# EAGLE design Hall Effect Arduino (EAGLE 6.5.0)
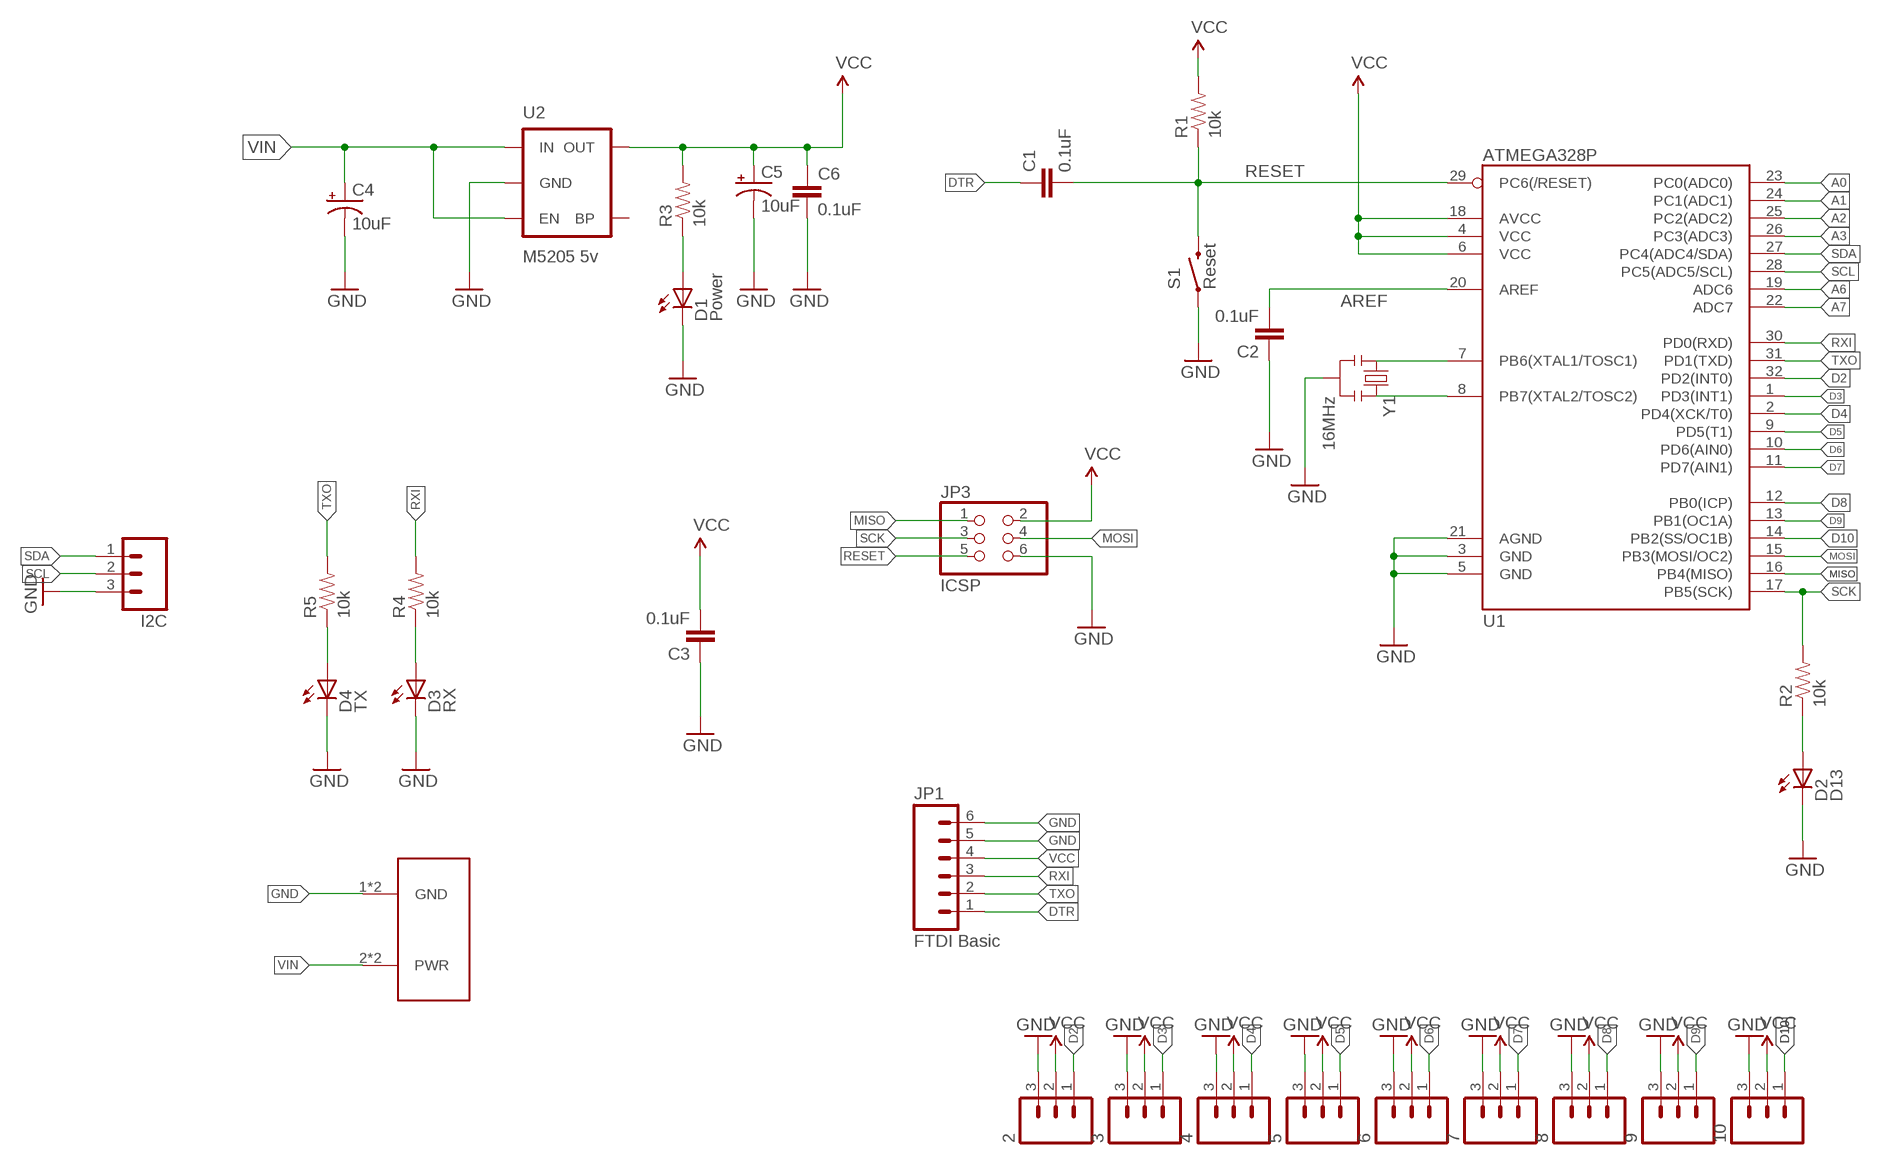
[diagram p0: schematic, sheet 1]

## Parts
2  M03PTH  [1X03]
3  M03PTH  [1X03]
4  M03PTH  [1X03]
5  M03PTH  [1X03]
6  M03PTH  [1X03]
7  M03PTH  [1X03]
8  M03PTH  [1X03]
9  M03PTH  [1X03]
10  M03PTH  [1X03]
C1  0.1uF  CAP0603-CAP  [0603-CAP]
C2  0.1uF  CAP0603-CAP  [0603-CAP]
C3  0.1uF  CAP0603-CAP  [0603-CAP]
C4  10uF  CAP_POL1206  [EIA3216]
C5  10uF  CAP_POL1206  [EIA3216]
C6  0.1uF  CAP0603-CAP  [0603-CAP]
D1  Power  LED-RED0603  [LED-0603]
D2  D13  LED-RED0603  [LED-0603]
D3  RX  LED-GREEN0603  [LED-0603]
D4  TX  LED-RED0603  [LED-0603]
I2C  M03PTH  [1X03]
JP1  FTDI Basic  M06SIP  [1X06]
JP3  ICSP  PINHD-2X3  [2X03]
R1  10k  RESISTOR0603-RES  [0603-RES]
R2  10k  RESISTOR0603-RES  [0603-RES]
R3  10k  RESISTOR0603-RES  [0603-RES]
R4  10k  RESISTOR0603-RES  [0603-RES]
R5  10k  RESISTOR0603-RES  [0603-RES]
S1  Reset  SWITCH-MOMENTARY-2SMD  [TACTILE_SWITCH_SMD]
U1  ATMEGA328P  ATMEGA328_SMT  [TQFP32-08]
U2  M5205 5v  MIC52055V  [SOT23-5]
U$1  LSF-SMT  [LSF-SMT]
Y1  16MHz  RESONATOR16MHZ  [RESONATOR-SMD]

## Nets
A0: U1.23(PC0(ADC0))
A1: U1.24(PC1(ADC1))
A2: U1.25(PC2(ADC2))
A3: U1.26(PC3(ADC3))
A6: U1.19(ADC6)
A7: U1.22(ADC7)
AREF: C2.2 U1.20(AREF)
D2: 2.1 U1.32(PD2(INT0))
D3: 3.1 U1.1(PD3(INT1))
D4: 4.1 U1.2(PD4(XCK/T0))
D5: 5.1 U1.9(PD5(T1))
D6: 6.1 U1.10(PD6(AIN0))
D7: 7.1 U1.11(PD7(AIN1))
D8: 8.1 U1.12(PB0(ICP))
D9: 9.1 U1.13(PB1(OC1A))
D10: 10.1 U1.14(PB2(SS/OC1B))
DTR: C1.1 JP1.1
GND: 2.3 3.3 4.3 5.3 6.3 7.3 8.3 9.3 10.3 C2.1 C3.1 C4.C(-) C5.C(-) C6.2 D1.C D2.C D3.C D4.C I2C.3 JP1.5 JP1.6 JP3.6 S1.1 U1.3(GND) U1.5(GND) U1.21(AGND) U2.2(GND) U$1.1(GND) U$1.1-2(GND) Y1.2
MISO: JP3.1 U1.16(PB4(MISO))
MOSI: JP3.4 U1.15(PB3(MOSI/OC2))
N$1: U1.7(PB6(XTAL1/TOSC1)) Y1.1
N$2: U1.8(PB7(XTAL2/TOSC2)) Y1.3
N$3: D1.A R3.1
N$4: D2.A R2.1
N$5: D3.A R4.1
N$6: D4.A R5.1
RESET: C1.2 JP3.5 R1.1 S1.3 U1.29(PC6(/RESET))
RXI: JP1.3 R4.2 U1.30(PD0(RXD))
SCK: JP3.3 R2.2 U1.17(PB5(SCK))
SCL: I2C.2 U1.28(PC5(ADC5/SCL))
SDA: I2C.1 U1.27(PC4(ADC4/SDA))
TXO: JP1.2 R5.2 U1.31(PD1(TXD))
VCC: 2.2 3.2 4.2 5.2 6.2 7.2 8.2 9.2 10.2 C3.2 C5.A(+) C6.1 JP1.4 JP3.2 R1.2 R3.2 U1.4(VCC) U1.6(VCC) U1.18(AVCC) U2.5(OUT)
VIN: C4.A(+) U2.1(IN) U2.3(EN) U$1.2(PWR) U$1.2-2(PWR)
Unconnected: U2.4(BP)

## Library data of the parts
2-10 I2C = SparkFun-Connectors:M03: Header 3 Standard 3-pin 0.1" header. Use with straight break away headers (SKU : PRT-00116), right angle break away headers (PRT-00553), swiss pins (PRT-00743), machine pins (PRT-00117), and female headers (PRT-00115). Molex polarized connector foot print use with SKU : PRT-08232 with associated crimp pins and housings.
C1-C3 C6 = SparkFun-Passives:CAP: Capacitor Standard 0603 ceramic capacitor, and 0.1" leaded capacitor.
C4 C5 = SparkFun-Passives:CAP_POL: Capacitor Polarized These are standard SMD and PTH capacitors. Normally 10uF, 47uF, and 100uF in electrolytic and tantalum varieties. Always verify the external diameter of the through hole cap, it varies with capacity, voltage, and manufacturer. The EIA devices should be standard.
D1 D2 D4 = SparkFun-LED:LED-RED: Assorted Red LEDs LilyPad 1206- DIO-09912 1206- DIO-00809 0603- DIO-00819; PROD_ID: DIO-00819; VALUE: RED
D3 = SparkFun-LED:LED-GREEN: Various green LEDs Green LEDs used in SFE Production 0603- DIO-00821 LARGE- DIO-00862 LILYPAD- DIO-09910; PROD_ID: DIO-00821; VALUE: GREEN
JP1 = SparkFun-Connectors:M06: Header 6 Standard 6-pin 0.1" header. Use with straight break away headers (SKU : PRT-00116), right angle break away headers (PRT-00553), swiss pins (PRT-00743), machine pins (PRT-00117), and female headers (PRT-00115). Molex polarized connector foot print use with SKU : PRT-08094 with associated crimp pins and housings. NOTES ON THE VARIANTS LOCK and LOCK_LONGPADS... This footprint was designed to help hold the alignment of a through-hole component (i.e. 6-pin header) while soldering it into place. You may notice that each hole has been shifted either up or down by 0.005 of an inch from it's more standard position (which is a perfectly straight line). This slight alteration caused the pins (the squares in the middle) to touch the edges of the holes. Because they are alternating, it causes a "brace" to hold the component in place. 0.005 has proven to be the perfect amount of "off-center" position when using our standard breakaway headers. Although looks a little odd when you look at the bare footprint, once you have a header in there, the alteration is very hard to notice. Also,if you push a header all the way into place, it is covered up entirely on the bottom side. This idea of altering the position of holes to aid alignment will be further integrated into the Sparkfun Library for other footprints. It can help hold any component with 3 or more connection pins.
JP3 = SparkFun-Connectors:PINHD-2X3: PIN HEADER
R1-R5 = SparkFun-Passives:RESISTOR: Resistor Basic schematic elements and footprints for 0603, 1206, and PTH resistors.
S1 = SparkFun-Electromechanical:SWITCH-MOMENTARY-2: Various NO switches- pushbuttons, reed, etc; PROD_ID: SWCH-08247
U1 = SparkFun-DigitalIC:ATMEGA328_SMT: 32-Pin Atmega328 part Commonly used on Arduino compatible boards Available in QFP and QFN packages TQFP is IC-09069 QFN is non-stock; PROD_ID: IC-09069
U2 = SparkFun-PowerIC:MIC5205: MIC5205 150mA vreg 3.3V - VREG-00822 5V - VREG-00823; PROD_ID: VREG-00823
U$1 = LSF-SMT:LSF-SMT
Y1 = SparkFun-FreqCtrl:RESONATOR: Resonator Small SMD resonator. Used, eg, on the Arduino Pro/ Pro Mini boards. 8MHz- XTAL-08895 16MHz- XTAL-08900; PROD_ID: XTAL-08900

## Board
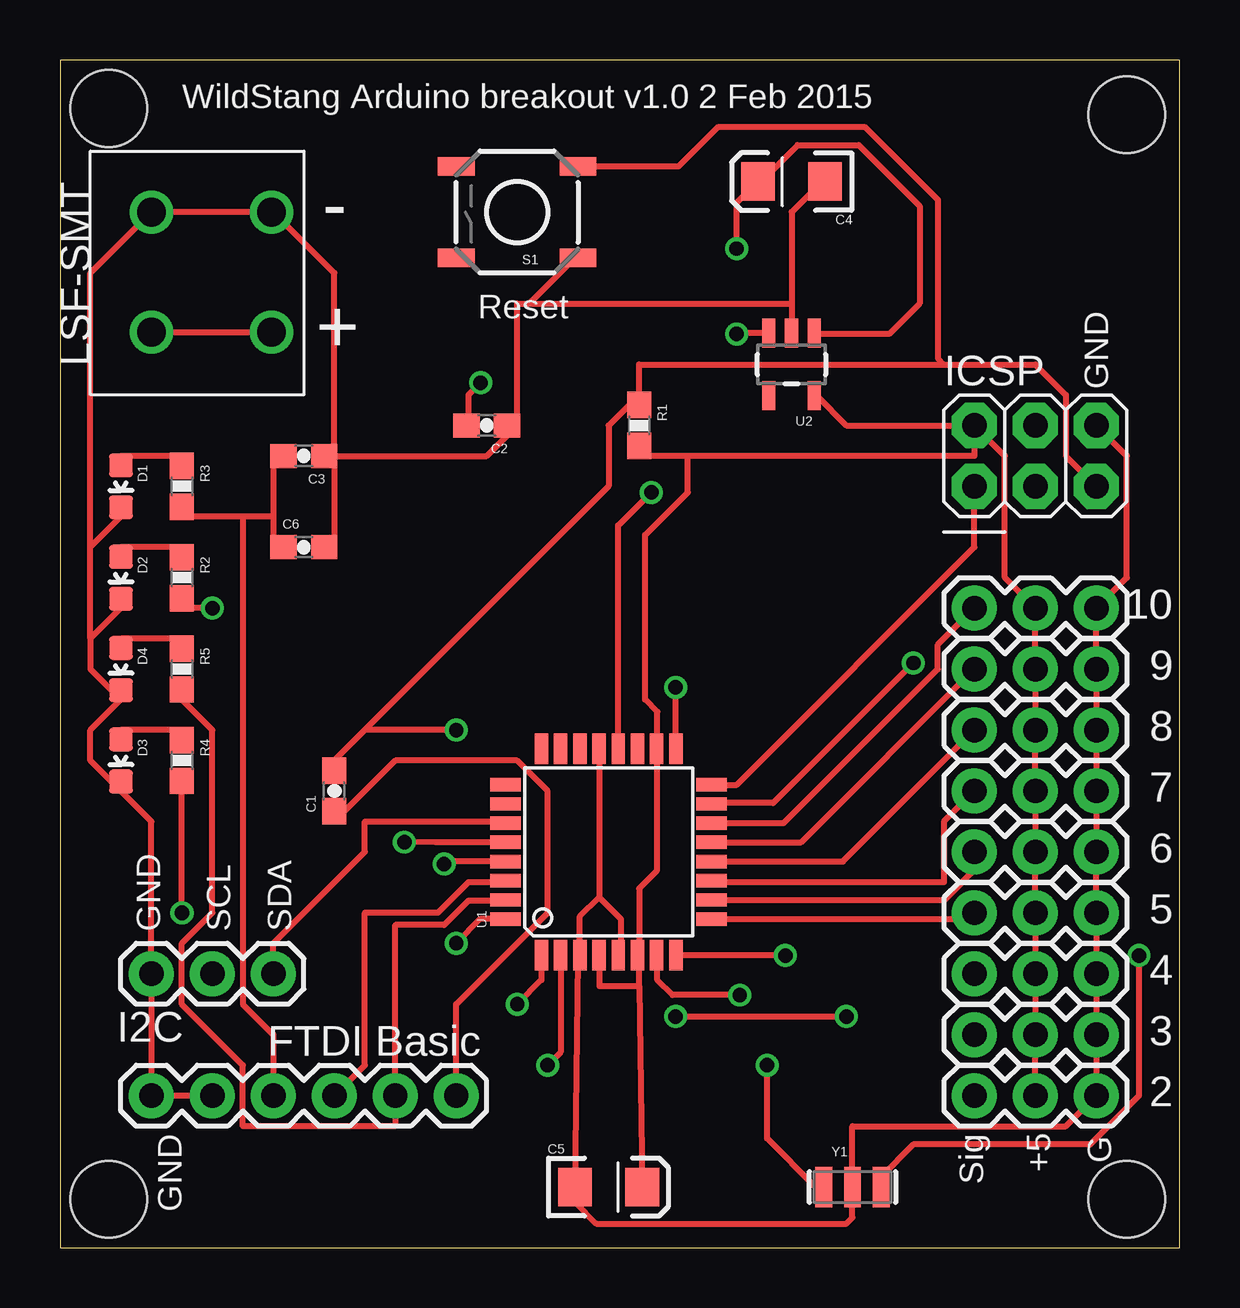
[diagram p1: board, top side]
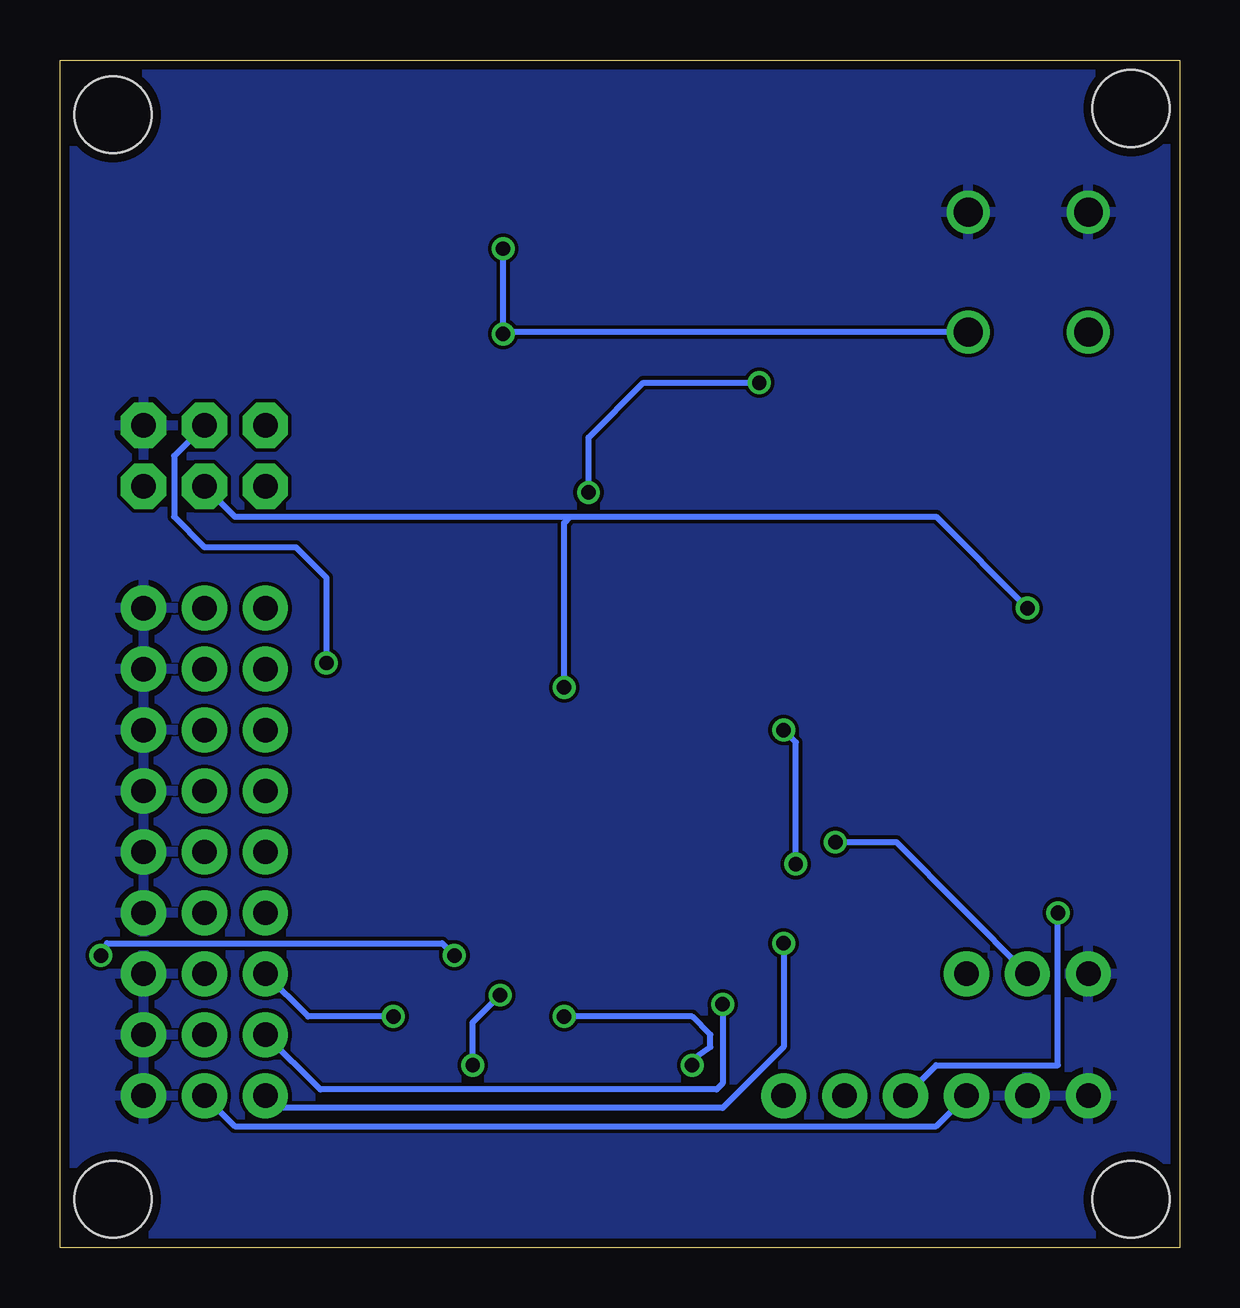
[diagram p2: board, bottom side, seen from below]

Size 46.66 x 49.52 mm. Coordinates in mm from the lower left corner, seen from the top.
Outline: 0,0 46.66,0 46.66,49.52 0,49.52 0,0
Copper layers (1*16): Top 0.0356mm / dielectric 1.5011mm / Bottom 0.0356mm
Design rules "LaenPCBOrder": minimum track width 6mil, minimum drill 13mil, track to track 6mil, track to pad 6mil, pad to pad 6mil, via to via 6mil, smd to smd 6mil, copper to edge 15mil, drill to drill 6mil, minimum pad ring 7mil, minimum via ring 7mil, stop-mask expansion 3mil, vias tented up to drill 0mil, thermal gap 10mil
Holes 3.2 mm at 2.03,2.03 44.45,2.03 2.03,47.5 44.45,47.24

### Footprints (pad centres in the part's own frame; a part is rotated, then mirrored left to right if it is on the bottom)
1X03 = drill 1.016 pad 1.88: 1 0,0; 2 2.54,0; 3 5.08,0
0603-CAP = smd 1.1 x 1: 1 -0.85,0; 2 0.85,0
EIA3216 = smd 1.4 x 1.6: A 1.4,0; C -1.4,0
LED-0603 = smd 1 x 1: A 0,-0.877; C 0,0.877
1X06 = drill 1.016 pad 1.88: 1 0,0; 2 2.54,0; 3 5.08,0; 4 7.62,0; 5 10.16,0; 6 12.7,0
2X03 = drill 1.016 pad 1.88 octagon: 1 -2.54,-1.27; 2 -2.54,1.27; 3 0,-1.27; 4 0,1.27; 5 2.54,-1.27; 6 2.54,1.27
0603-RES = smd 1.1 x 1: 1 -0.85,0; 2 0.85,0
TACTILE_SWITCH_SMD = smd 1.524 x 0.762: 1 -2.54,1.905; 2 2.54,1.905; 3 -2.54,-1.905; 4 2.54,-1.905
TQFP32-08 = smd 1.27 x 0.559: 1 -4.293,2.8; 2 -4.293,2; 3 -4.293,1.2; 4 -4.293,0.4; 5 -4.293,-0.4; 6 -4.293,-1.2; 7 -4.293,-2; 8 -4.293,-2.8; 17 4.293,-2.8; 18 4.293,-2; 19 4.293,-1.2; 20 4.293,-0.4; 21 4.293,0.4; 22 4.293,1.2; 23 4.293,2; 24 4.293,2.8 | smd 0.559 x 1.27: 9 -2.8,-4.293; 10 -2,-4.293; 11 -1.2,-4.293; 12 -0.4,-4.293; 13 0.4,-4.293; 14 1.2,-4.293; 15 2,-4.293; 16 2.8,-4.293; 25 2.8,4.293; 26 2,4.293; 27 1.2,4.293; 28 0.4,4.293; 29 -0.4,4.293; 30 -1.2,4.293; 31 -2,4.293; 32 -2.8,4.293
SOT23-5 = smd 0.55 x 1.2: 1 -0.95,-1.3; 2 0,-1.3; 3 0.95,-1.3; 4 0.95,1.3; 5 -0.95,1.3
LSF-SMT = drill 1.199: 1 0,5.004; 1-2 0,0; 2 5.004,5.004; 2-2 5.004,0
RESONATOR-SMD = smd 0.7 x 1.7: 1 -1.2,0; 2 0,0; 3 1.2,0

### Placement (x,y rotation side)
2  38.1,6.35 0 top
3  38.1,8.89 0 top
4  38.1,11.43 0 top
5  38.1,13.97 0 top
6  38.1,16.51 0 top
7  38.1,19.05 0 top
8  38.1,21.59 0 top
9  38.1,24.13 0 top
10  38.1,26.67 0 top
C1  11.43,19.05 90 top
C2  17.78,34.29 180 top
C3  10.16,33.02 180 top
C4  30.48,44.45 180 top
C5  22.86,2.54 0 top
C6  10.16,29.21 0 top
D1  2.54,31.75 180 top
D2  2.54,27.94 180 top
D3  2.54,20.32 180 top
D4  2.54,24.13 180 top
I2C  8.89,11.43 180 top
JP1  16.51,6.35 180 top
JP3  40.64,33.02 0 top
R1  24.13,34.29 270 top
R2  5.08,27.94 270 top
R3  5.08,31.75 270 top
R4  5.08,20.32 270 top
R5  5.08,24.13 270 top
S1  19.05,43.18 180 top
U1  22.86,16.51 90 top
U2  30.48,36.83 180 top
U$1  3.81,43.18 270 top
Y1  33.02,2.54 0 top

### Tracks (layer width: path | path; a pad name or v marks a point on that pad's centre or on a via)
AREF  (via drill 0.6)
  Top 0.254: U1.20 23.26,30.12 v24.64,31.5 | v17.53,36.07 17.02,35.56 17.02,34.38 C2.2
  Bottom 0.254: v24.64,31.5 24.64,33.78 22.35,36.07 v17.53,36.07
D2  (via drill 0.6)
  Top 0.254: U1.32 17.52,13.71 v16.51,12.7
  Bottom 0.254: v16.51,12.7 16.51,8.38 19.05,5.84 37.59,5.84 2.1
D3  (via drill 0.6)
  Top 0.254: U1.1 20.06,11.17 v19.05,10.16
  Bottom 0.254: v19.05,10.16 19.05,6.86 19.3,6.6 35.81,6.6 3.1
D4  (via drill 0.6)
  Top 0.254: U1.2 20.86,8.16 v20.32,7.62 | v25.65,9.65 v32.77,9.65
  Bottom 0.254: v20.32,7.62 20.32,7.87 19.56,8.38 19.56,8.89 20.32,9.65 v25.65,9.65 | 4.1 36.32,9.65 v32.77,9.65
D5
  Top 0.254: U1.9 37.84,13.71 5.1
D6
  Top 0.254: U1.10 36.86,14.51 38.35,16 38.35,16.26 6.1
D7
  Top 0.254: 7.1 36.83,17.78 36.83,15.24 26.67,15.24 U1.11
D8
  Top 0.254: U1.12 32.62,16.11 8.1
D9
  Top 0.254: U1.13 30.88,16.91 9.1
D10
  Top 0.254: U1.14 30.16,17.71 36.58,24.13 36.58,25.15 10.1
DTR
  Top 0.254: JP1.1 16.51,10.16 20.32,13.97 20.32,19.05 19.05,20.32 13.97,20.32 11.43,17.78 C1.1
GND
  Top 0.254: 30.48,39.37 30.48,43.18 31.75,44.45 C4.C | 30.48,39.37 U2.2 30.48,38.1 | 11.43,33.02 11.43,29.21 C6.2 | 19.05,34.29 17.78,33.02 11.43,33.02 | 19.56,39.37 19.05,39.37 19.05,34.29 | 19.56,39.37 30.48,39.37 | 19.05,34.29 C2.1 | 11.43,33.02 11.43,40.64 8.89,43.18 U$1.1 U$1.1-2 1.27,40.64 1.27,29.21 | 11.43,33.02 C3.1 | JP3.6 44.45,33.02 44.45,27.94 10.3 9.3 8.3 7.3 6.3 5.3 4.3 3.3 2.3 41.91,5.08 33.02,5.08 Y1.2 33.02,1.27 32.77,1.02 22.35,1.02 21.46,1.91 C5.C 21.59,12.02 U1.3 21.66,13.82 22.46,14.62 | JP1.5 JP1.6 I2C.3 3.81,17.78 2.54,19.05 | 2.54,22.86 1.27,24.13 1.27,25.4 | 1.27,25.4 2.54,26.67 D2.C | 1.27,29.21 2.54,30.48 D1.C | 1.27,25.4 1.27,29.21 | 2.54,22.86 1.27,21.59 1.27,20.32 2.54,19.05 | 2.54,22.86 D4.C | 2.54,19.05 D3.C | S1.1 21.46,41.27 19.56,39.37 | U1.21 22.46,14.62 | 22.46,14.62 23.37,13.72 23.37,12.32 U1.5
  pour Bottom: 0,49.28 0.25,0 46.74,0 46.48,49.78 0,49.78
MISO
  Top 0.254: U1.16 28.2,19.31 38.1,29.21 JP3.1
MOSI  (via drill 0.6)
  Top 0.254: v35.56,24.38 35.56,24.13 35.31,24.13 29.72,18.54 27.18,18.54 U1.15
  Bottom 0.254: JP3.4 41.91,33.02 41.91,30.48 40.64,29.21 36.83,29.21 35.56,27.94 v35.56,24.38
N$1  (via drill 0.6)
  Top 0.254: Y1.1 31.5,2.54 29.46,4.57 v29.46,7.62 | v28.32,10.54 25.53,10.54 24.89,11.18 24.89,12.19 U1.7
  Bottom 0.254: v29.46,7.62 29.46,9.4 v28.32,10.54
N$2  (via drill 0.6)
  Top 0.254: Y1.3 34.22,2.98 35.56,4.32 42.93,4.32 44.96,6.35 v44.96,12.19 | v30.23,12.19 25.68,12.19 U1.8
  Bottom 0.254: v44.96,12.19 44.7,12.7 30.73,12.7 v30.23,12.19
N$3
  Top 0.254: D1.A 2.54,33.02 5.08,33.02 R3.1
N$4
  Top 0.254: D2.A 2.54,29.21 5.08,29.21 R2.1
N$5
  Top 0.254: D3.A 2.54,21.59 5.08,21.59 R4.1
N$6
  Top 0.254: D4.A 2.54,25.4 5.08,25.4 R5.1
RESET  (via drill 0.6)
  Top 0.254: 12.7,21.59 22.86,31.75 22.86,34.29 24.13,35.56 | C1.2 11.43,20.32 12.7,21.59 | JP3.5 41.91,33.02 41.91,35.56 40.64,36.83 36.83,36.83 | 36.83,36.83 24.13,36.83 24.13,35.56 | 24.13,35.56 R1.1 | S1.3 25.78,45.09 27.43,46.74 33.53,46.74 36.58,43.69 36.58,37.08 36.83,36.83 | v16.51,21.59 12.7,21.59 | U1.29 16.11,16.11 v16,16
  Bottom 0.254: v16,16 16,21.08 v16.51,21.59
RXI  (via drill 0.61)
  Top 0.254: v5.08,13.97 R4.2 | JP1.3 12.7,7.62 12.7,13.97 15.75,13.97 17.02,15.24 19.05,15.24 U1.30
  Bottom 0.254: v5.08,13.97 5.08,7.62 10.16,7.62 JP1.3
SCK  (via drill 0.6, 0.61)
  Top 0.254: v6.35,26.67 5.08,26.67 R2.2 | U1.17 v25.66,23.36 v25.65,23.37
  Bottom 0.254: v6.35,26.67 10.16,30.48 25.4,30.48 | 25.4,30.48 39.37,30.48 JP3.3 | v25.65,23.37 25.65,30.23 25.4,30.48
SCL  (via drill 0.6)
  Top 0.254: U1.28 15.64,16.91 v14.35,16.92
  Bottom 0.254: v14.35,16.92 11.81,16.92 I2C.2
SDA
  Top 0.254: I2C.1 8.89,12.7 12.7,16.51 12.7,17.78 19.05,17.78 U1.27
TXO
  Top 0.254: R5.2 5.08,22.86 6.35,21.59 6.35,13.97 5.08,12.7 5.08,10.16 7.62,7.62 7.62,5.08 13.97,5.08 JP1.2 13.97,13.46 16,13.46 17.02,14.48 18.54,14.48 U1.31
VCC
  Top 0.254: 8.89,30.48 8.89,33.02 C3.2 | 8.89,30.48 8.89,29.21 C6.1 | 8.89,30.48 7.62,30.48 | 7.62,30.48 5.08,30.48 R3.2 | JP1.4 8.89,8.89 7.62,10.16 7.62,30.48 | 26.16,33.02 38.1,33.02 JP3.2 | 26.16,33.02 24.13,33.02 R1.2 | JP3.2 39.37,33.02 39.37,27.94 10.2 9.2 8.2 7.2 6.2 5.2 4.2 3.2 2.2 | U2.5 31.53,35.53 32.77,34.29 JP3.2 | 24.13,10.92 C5.A | U1.4 22.48,12.22 22.48,10.92 24.13,10.92 | 24.13,10.92 24.13,12.22 U1.6 24.13,12.29 24.13,14.99 24.86,15.72 U1.18 24.89,20.8 24.89,22.35 24.38,22.86 24.38,29.72 26.16,31.5 26.16,33.02
  Bottom 0.254: JP1.4 10.16,5.08 39.37,5.08 2.2
VIN  (via drill 0.6)
  Top 0.254: U2.3 28.19,38.13 v28.19,38.1 | v28.19,41.66 28.19,43.56 C4.A 29.21,44.45 30.73,45.97 33.27,45.97 35.81,43.43 35.81,39.37 34.54,38.1 31.46,38.1 U2.1 | U$1.2-2 U$1.2
  Bottom 0.254: v28.19,41.66 v28.19,38.1 28.12,38.18 U$1.2

### Text on the board
tPlace: WildStang Arduino breakout v1.0 2 Feb 2015 | - | Reset | + | GND | GND | SCL | SDA | G | Sig | +5 | GND